# Altium schematic sheet Controller.SchDoc
size A
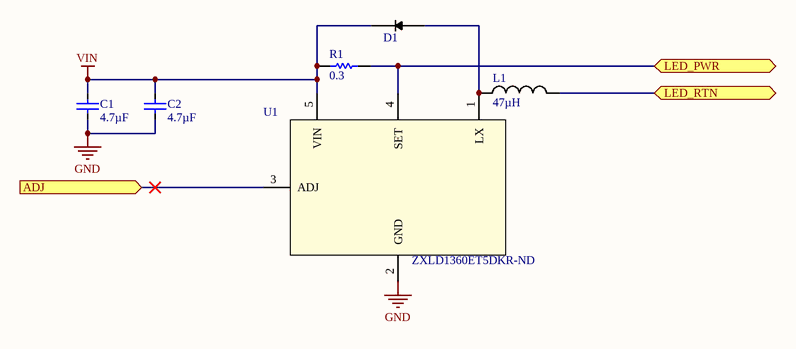
[diagram p0: Controller.SchDoc]

## Parts
C1  4.7µF  [CAP_1206]
C2  4.7µF  [CAP_1206]
D1  DIODE  [DO-214AA(SMB)]  (value not drawn)
L1  47µH  [INDUCTOR_BOURNS_SRN8040]
R1  0.3  [RES_0805]
U1  Supplier Part Number 1: ZXLD1360ET5DKR-ND  [SOT95P245X110-5N]  (hidden comment: ZXLD1360)

## Ports
ADJ (in), LED_PWR, LED_RTN

## Nets
GND: C1.2 C2.2 U1.2(GND)
VIN: C1.1 C2.1 D1.1(A) R1.1 U1.5(VIN)
ADJ: U1.3(ADJ) ; port ADJ
LED_PWR: R1.2 U1.4(SET) ; port LED_PWR
LED_RTN: L1.2 ; port LED_RTN
NetD1_2: D1.2(K) L1.1 U1.1(LX)

## Library data of the parts
C1 C2 = CAPACITOR: Manufacturer: TDK Corporation; Manufacturer Part Number: C3216X7R1V475M160AE; Temperature Coefficient: X7R; Voltage - Rated: 35V; Capacitance: 4.7µF; Package / Case: 1206 (3216 Metric); Supplier 1: Digi-Key; Supplier Part Number 1: 445-6813-2-ND; Applications: Boardflex Sensitive; Operating Temperature: -55°C ~ 125°C
D1 = DIODE: Voltage - DC Reverse (Vr) (Max): 40V; Voltage - Forward (Vf) (Max) @ If: 500mV @ 2A; Diode Type: Schottky; Current - Reverse Leakage @ Vr: 400µA @ 40V; Current - Average Rectified (Io): 2A; Description: DIODE SCHOTTKY 40V 2A SMB; Supplier 1: Digi-Key; Supplier Part Number 1: SS24T3GOSCT-ND; Operating Temperature - Junction: -55°C ~ 150°C
L1 = INDUCTOR: Manufacturer: Bourns Inc.; Manufacturer Part Number: SRN8040-470M; Tolerance: ±20%; DC Resistance (DCR): 190 mOhm Max; Current - Saturation: 1.5A; Frequency - Test: 100kHz; Current Rating: 1.4A; Inductance: 47µH; Supplier 1: Digi-Key; Supplier Part Number 1: SRN8040-470MDKR-ND; ComponentLink1URL: http://www.bourns.com/data/global/pdfs/SRN8040.pdf; ComponentLink1Description: http://www.bourns.com/data/global/pdfs/SRN8040.pdf
R1 = RESISTOR: Manufacturer Part Number: RLP73N2AR30JTD; Manufacturer: TE Connectivity; Power (Watts): 0.25W, 1/4W; Tolerance: ±5%; Temperature Coefficient: ±300ppm/°C; Supplier 1: Digi-Key; Supplier Part Number 1: A109804DKR-ND; Resistance: 0.3
U1 = ZXLD1360: Supplier 1: Digi-Key